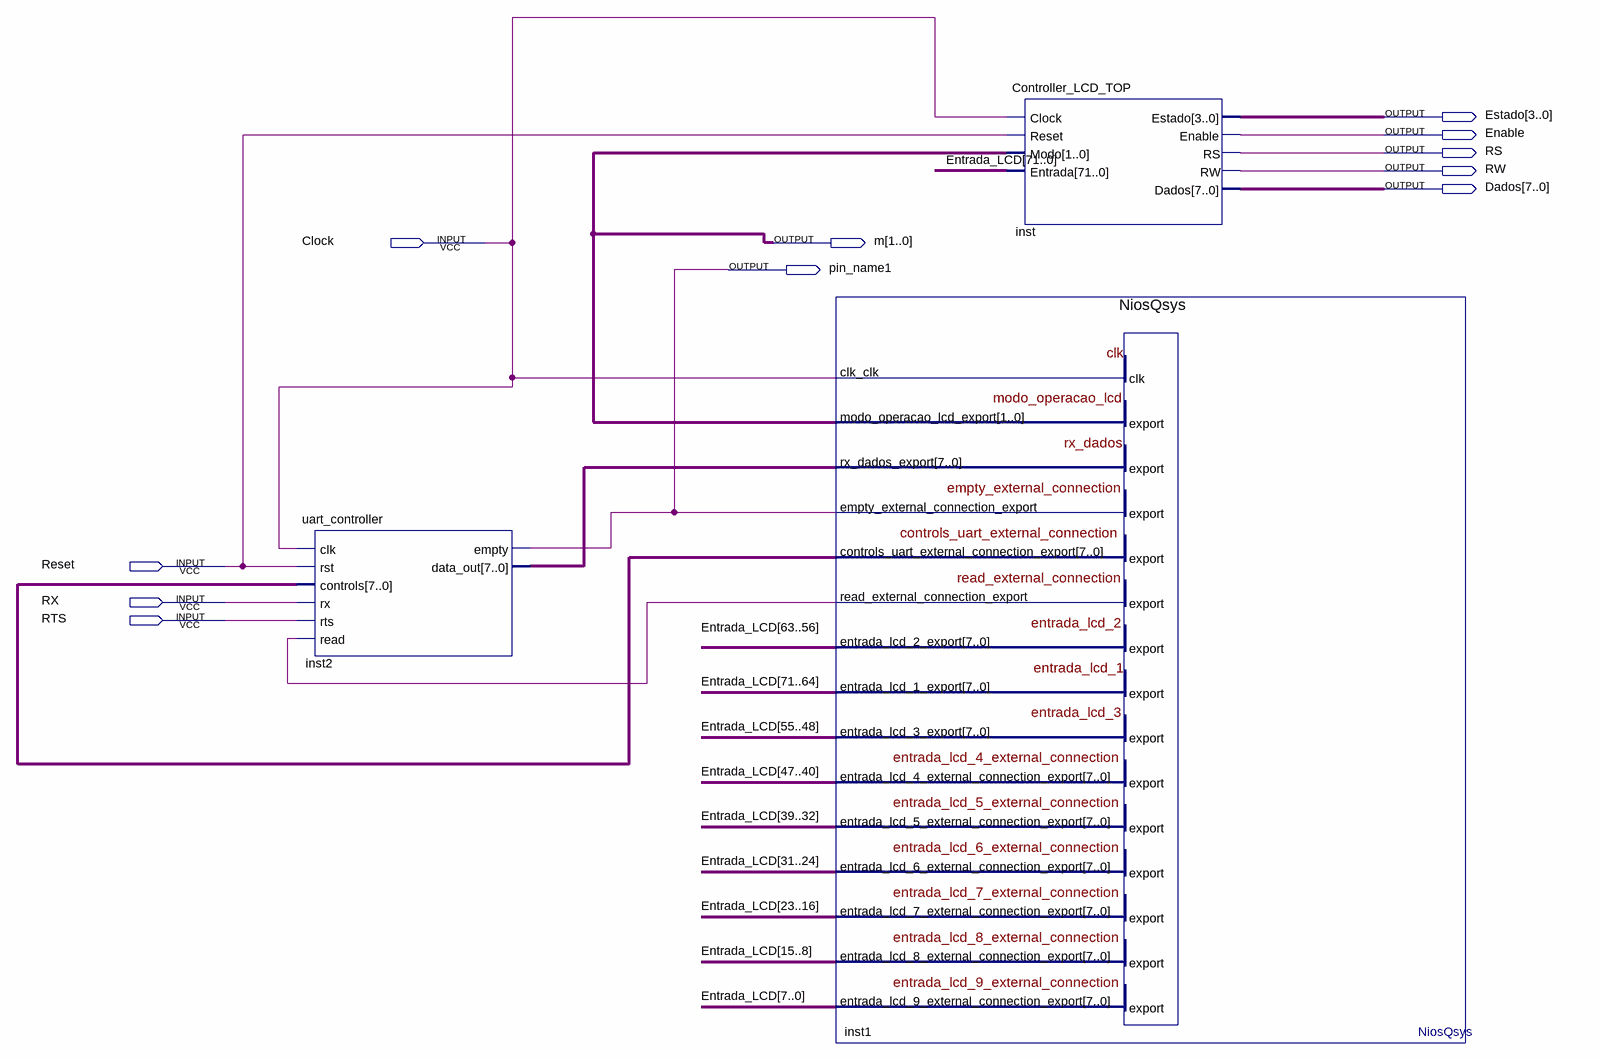
[diagram p0: schematic sheet]
// Quartus schematic projeto_crc.bdf as structural Verilog: 3 symbols, 11 pins
module projeto_crc (
  input  Clock,
  input  Reset,
  input  RX,
  input  RTS,
  output [3:0] Estado,
  output Enable,
  output RS,
  output RW,
  output [7:0] Dados,
  output [1:0] m,
  output pin_name1
);

  wire inst1_read_external_connection_export;
  wire [7:0] inst1_controls_uart_external_connection_export, inst2_data_out;
  wire [71:0] Entrada_LCD;

  uart_controller inst2 (
    .clk(Clock), .rst(Reset), .controls(inst1_controls_uart_external_connection_export), .rx(RX), .rts(RTS),
    .read(inst1_read_external_connection_export), .empty(pin_name1), .data_out(inst2_data_out));
  NiosQsys inst1 (
    .clk_clk(Clock), .rx_dados_export(inst2_data_out), .empty_external_connection_export(pin_name1),
    .modo_operacao_lcd_export(m),
    .controls_uart_external_connection_export(inst1_controls_uart_external_connection_export),
    .read_external_connection_export(inst1_read_external_connection_export),
    .entrada_lcd_2_export(Entrada_LCD[63:56]), .entrada_lcd_1_export(Entrada_LCD[71:64]),
    .entrada_lcd_3_export(Entrada_LCD[55:48]), .entrada_lcd_4_external_connection_export(Entrada_LCD[47:40]),
    .entrada_lcd_5_external_connection_export(Entrada_LCD[39:32]),
    .entrada_lcd_6_external_connection_export(Entrada_LCD[31:24]),
    .entrada_lcd_7_external_connection_export(Entrada_LCD[23:16]),
    .entrada_lcd_8_external_connection_export(Entrada_LCD[15:8]),
    .entrada_lcd_9_external_connection_export(Entrada_LCD[7:0]));
  Controller_LCD_TOP inst (
    .Clock(Clock), .Reset(Reset), .Modo(m), .Entrada(Entrada_LCD), .Estado(Estado), .Enable(Enable), .RS(RS),
    .RW(RW), .Dados(Dados));
endmodule
